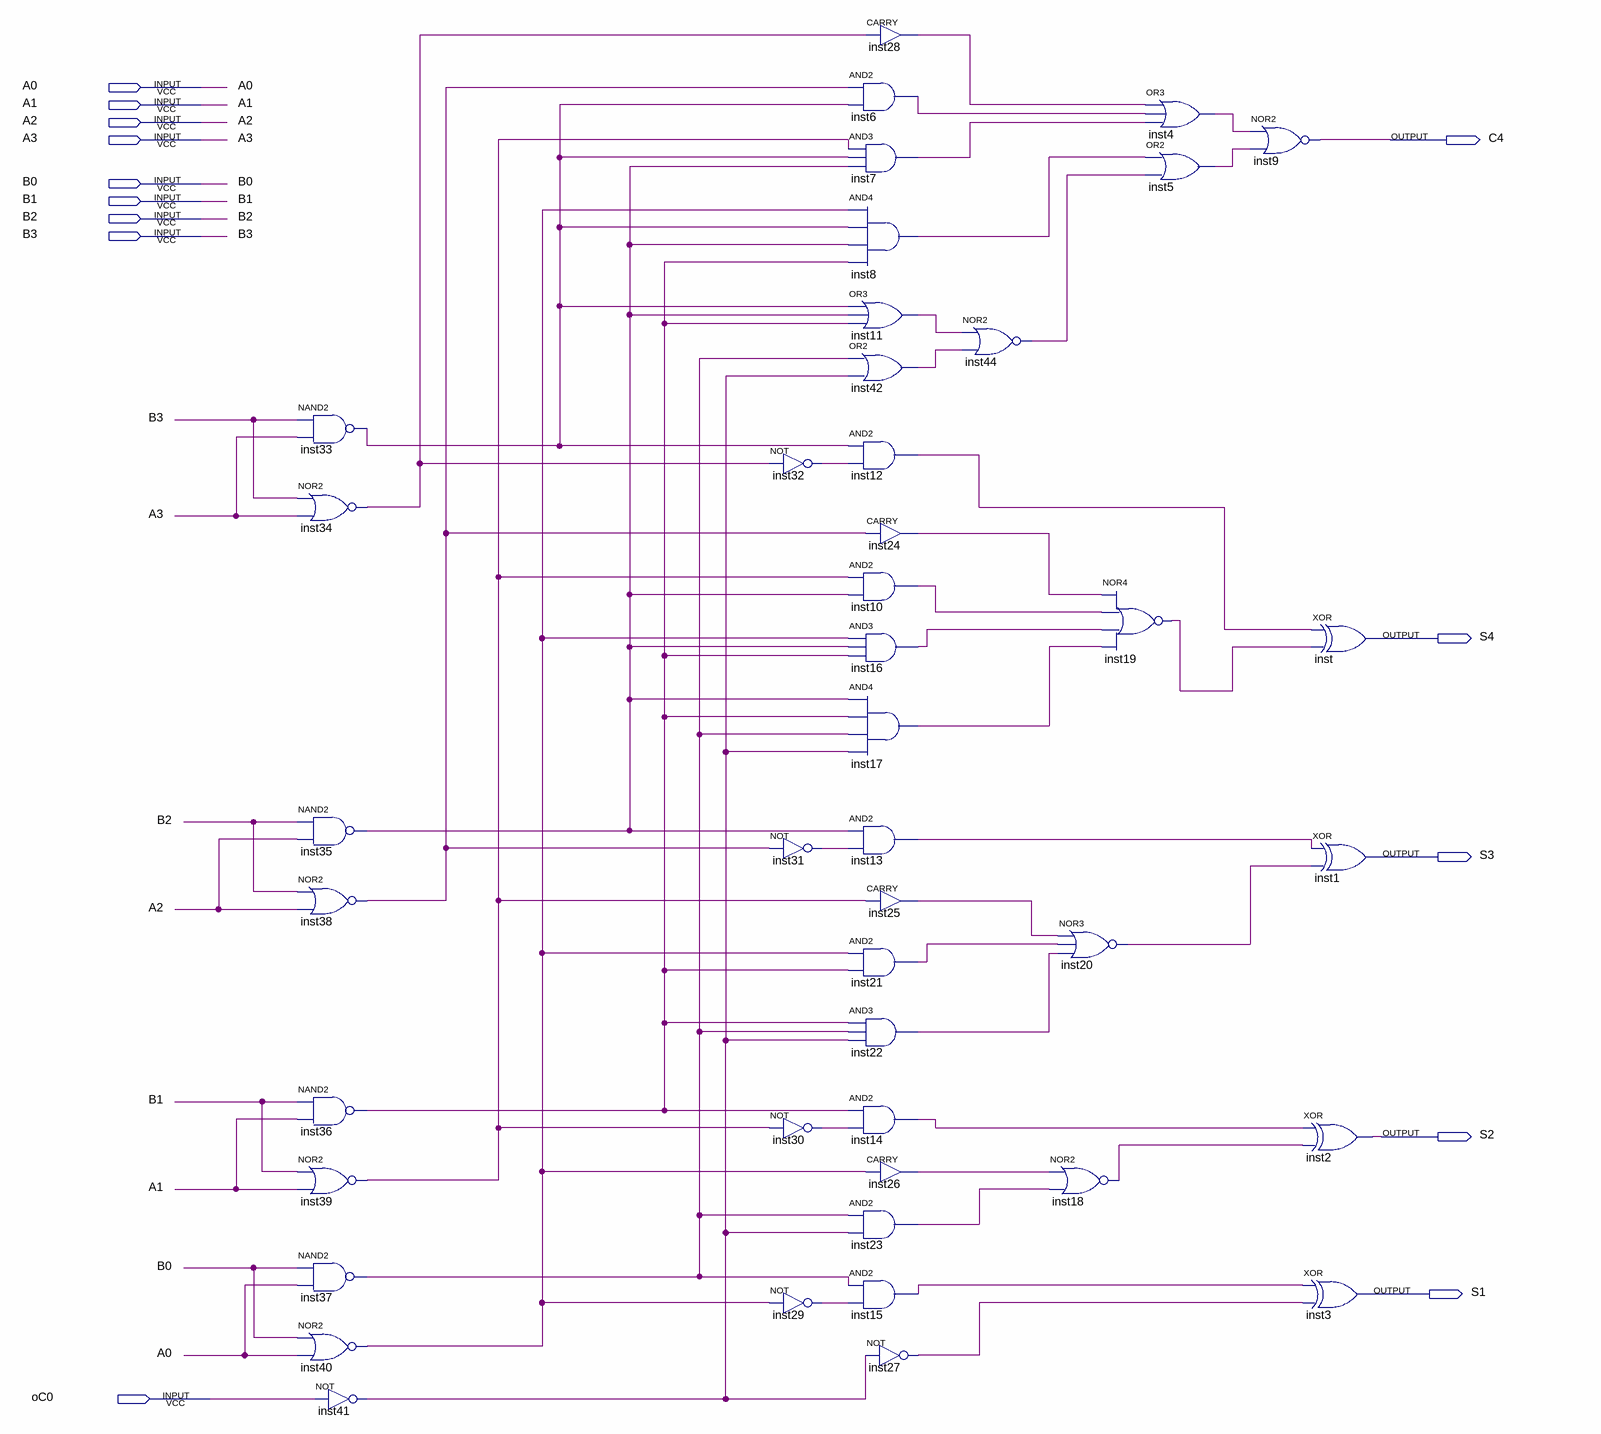
[diagram p0: schematic sheet]
// Quartus schematic Latch_SM_SB.bdf as structural Verilog: 44 symbols, 14 pins
module Latch_SM_SB (
  input  A0,
  input  A1,
  input  A2,
  input  A3,
  input  B0,
  input  B1,
  input  B2,
  input  B3,
  input  oC0,
  output C4,
  output S4,
  output S3,
  output S2,
  output S1
);

  wire inst4_out, inst5_out, inst6_out, inst7_out, inst8_out, inst10_out, inst11_out, inst12_out, inst13_out,
       inst14_out, inst15_out, inst16_out, inst17_out, inst18_out, inst19_out, inst20_out, inst21_out,
       inst22_out, inst23_out, inst24_out, inst25_out, inst26_out, inst27_out, inst28_out, inst29_out,
       inst30_out, inst31_out, inst32_out, inst33_out, inst34_out, inst35_out, inst36_out, inst37_out,
       inst38_out, inst39_out, inst40_out, inst41_out, inst42_out, inst44_out;

  nand inst33 (inst33_out, B3, A3);
  nor inst34 (inst34_out, B3, A3);
  nand inst35 (inst35_out, B2, A2);
  nor inst38 (inst38_out, B2, A2);
  nand inst36 (inst36_out, B1, A1);
  nor inst39 (inst39_out, B1, A1);
  nand inst37 (inst37_out, B0, A0);
  nor inst40 (inst40_out, B0, A0);
  not inst41 (inst41_out, oC0);
  not inst32 (inst32_out, inst34_out);
  not inst31 (inst31_out, inst38_out);
  not inst30 (inst30_out, inst39_out);
  not inst29 (inst29_out, inst40_out);
  and inst6 (inst6_out, inst38_out, inst33_out);
  and inst7 (inst7_out, inst39_out, inst33_out, inst35_out);
  and inst8 (inst8_out, inst40_out, inst33_out, inst35_out, inst36_out);
  or inst11 (inst11_out, inst33_out, inst35_out, inst36_out);
  or inst42 (inst42_out, inst37_out, inst41_out);
  and inst12 (inst12_out, inst33_out, inst32_out);
  and inst10 (inst10_out, inst39_out, inst35_out);
  and inst16 (inst16_out, inst40_out, inst35_out, inst36_out);
  and inst17 (inst17_out, inst35_out, inst36_out, inst37_out, inst41_out);
  and inst13 (inst13_out, inst35_out, inst31_out);
  and inst21 (inst21_out, inst40_out, inst36_out);
  and inst22 (inst22_out, inst36_out, inst37_out, inst41_out);
  and inst14 (inst14_out, inst36_out, inst30_out);
  and inst23 (inst23_out, inst37_out, inst41_out);
  and inst15 (inst15_out, inst37_out, inst29_out);
  CARRY inst28 (.IN(inst34_out), .OUT(inst28_out));
  CARRY inst24 (.IN(inst38_out), .OUT(inst24_out));
  CARRY inst25 (.IN(inst39_out), .OUT(inst25_out));
  CARRY inst26 (.IN(inst40_out), .OUT(inst26_out));
  not inst27 (inst27_out, inst41_out);
  nor inst44 (inst44_out, inst11_out, inst42_out);
  nor inst20 (inst20_out, inst25_out, inst21_out, inst22_out);
  nor inst18 (inst18_out, inst26_out, inst23_out);
  nor inst19 (inst19_out, inst24_out, inst10_out, inst16_out, inst17_out);
  or inst4 (inst4_out, inst28_out, inst6_out, inst7_out);
  or inst5 (inst5_out, inst8_out, inst44_out);
  nor inst9 (C4, inst4_out, inst5_out);
  xor inst (S4, inst12_out, inst19_out);
  xor inst1 (S3, inst13_out, inst20_out);
  xor inst2 (S2, inst14_out, inst18_out);
  xor inst3 (S1, inst15_out, inst27_out);
endmodule
